# Altium schematic sheet EFR32BG24_PartC.SchDoc: LPEDT_Project_Schematic
size A; Revision: 1; SheetNumber: 6; SheetTotal: 7
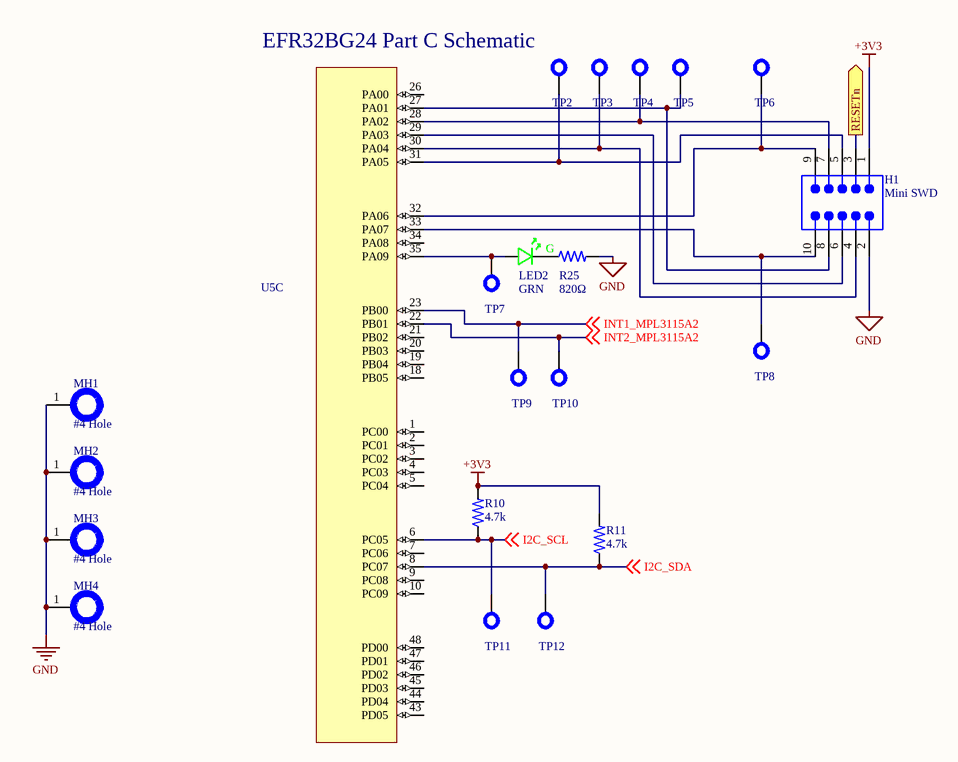
[diagram p0: EFR32BG24_PartC.SchDoc]

## Parts
H1  Mini SWD  [FTSH-105-01-XXX-DV-K]
LED2  GRN  [LED_0603]
MH1  #4 Hole  [HOLE_#4]  (no BOM)
MH2  #4 Hole  [HOLE_#4]  (no BOM)
MH3  #4 Hole  [HOLE_#4]  (no BOM)
MH4  #4 Hole  [HOLE_#4]  (no BOM)
R10  4.7k  [R_0603]
R11  4.7k  [R_0603]
R25  820Ω  [R_0603]
TP2  TP_1PIN_Hole  [Test Point]  (value not drawn)
TP3  TP_1PIN_Hole  [Test Point]  (value not drawn)
TP4  TP_1PIN_Hole  [Test Point]  (value not drawn)
TP5  TP_1PIN_Hole  [Test Point]  (value not drawn)
TP6  TP_1PIN_Hole  [Test Point]  (value not drawn)
TP7  TP_1PIN_Hole  [Test Point]  (value not drawn)
TP8  TP_1PIN_Hole  [Test Point]  (value not drawn)
TP9  TP_1PIN_Hole  [Test Point]  (value not drawn)
TP10  TP_1PIN_Hole  [Test Point]  (value not drawn)
TP11  TP_1PIN_Hole  [Test Point]  (value not drawn)
TP12  TP_1PIN_Hole  [Test Point]  (value not drawn)
U5  EFR32BG24B110F1536IM48-B  [U_48QFN_6x6_2]  (value not drawn)  (part C of 3)

## Ports
RESETn (out, see EFR32BG24_PartB[2A])

## Nets
+3V3: H1.1 R10.2 R11.2
GND: H1.2 MH1.1 MH2.1 MH3.1 MH4.1 R25.2
I2C_SCL: R10.1 TP11.1 U5.6(PC05) ; off-sheet I2C_SCL
I2C_SDA: R11.1 TP12.1 U5.8(PC07) ; off-sheet I2C_SDA
INT1_MPL3115A2: TP9.1 U5.23(PB00) ; off-sheet INT1_MPL3115A2
INT2_MPL3115A2: TP10.1 U5.22(PB01) ; off-sheet INT2_MPL3115A2
RESETn: H1.3 ; port RESETn
NetH1_4: H1.4 TP3.1 U5.30(PA04)
NetH1_5: H1.5 TP2.1 U5.31(PA05)
NetH1_6: H1.6 U5.29(PA03)
NetH1_7: H1.7 TP4.1 U5.28(PA02)
NetH1_8: H1.8 TP5.1 U5.27(PA01)
NetH1_9: H1.9 TP6.1 U5.32(PA06)
NetH1_10: H1.10 TP8.1 U5.33(PA07)
NetLED2_A: LED2.A TP7.1 U5.35(PA09)
NetLED2_C: LED2.C R25.1

Not connected (* = marked no-connect by the designer): U5 1(PC00) 2(PC01) 3(PC02) 4(PC03) 5(PC04) 7(PC06) 9(PC08) 10(PC09) 18(PB05) 19(PB04) 20(PB03) 21(PB02) 26(PA00) 34(PA08) 43(PD05) 44(PD04) 45(PD03) 46(PD02) 47(PD01) 48(PD00)

## Notes on the sheet
- (near TP2) EFR32BG24 Part C Schematic
- (in symbol LED_GREEN_0603) G

## Library data of the parts
H1 = Debug Connector Mini SWD - 0.05": Mini SWD 0.05" Pitch Connector - 10 Pin SMT Box Header; Manufacturer: Adafruit Industries; Manufacturer Part Number: 4048; Supplier 1: Digi-Key; RoHS: No; Category: Connectors; Stock 1: 201; Pricing 1: 1=1.95000 (USD); ComponentLink1URL: https://media.digikey.com/pdf/Data%20Sheets/Adafruit%20PDFs/4048_Web.pdf?src-supplier=Digi-Key; ComponentLink1Description: https://media.digikey.com/pdf/Data%20Sheets/Adafruit%20PDFs/4048_Web.pdf?src-supplier=Digi-Key
LED2 = LED_GREEN_0603: LED, 0603, GREEN, 430MCD, 520NM; Manufacturer: Wurth Electronics; Manufacturer Part Number: 150060GS75000; Dynamic Catalog: 0603 Rectangle with Flat Top Chip LEDs; 3D Model: SMCW_0603.igs / SMCW_0603.stp / SMCW_0603.wrl; Wavelength - Peak: 515nm; Voltage - Forward (Vf) (Typ): 3.2V; Current - Test: 20mA; Viewing Angle: 140°; Lens Type: Clear; Lens Style/Size: Rectangle with Flat Top, 1.1mm x 0.7mm; Other Names: 732-4971-2; Supplier 1: Digi-Key; Stock 1: 34964; Pricing 1: 1=0.14, 50=0.129, 100=0.11, 500=0.095 (USD); Standard Package: 4,000; Category: Optoelectronics; Family: LED Indication - Discrete; Series: WL-SMCW; Packaging: Tape & Reel (TR); Color: Green; Wavelength - Dominant: 520nm; Millicandela Rating: 430mcd; Package / Case: 0603 (1608 Metric); Size / Dimension: 1.60mm L x 0.80mm W; Height: 0.70mm; Mounting Type: Surface Mount; Online Catalog: 0603 Rectangle with Flat Top Chip LEDs; ComponentLink1URL: https://katalog.we-online.de/led/datasheet/150060GS75000.pdf?src-supplier=Digi-Key; ComponentLink1Description: https://katalog.we-online.de/led/datasheet/150060GS75000.pdf?src-supplier=Digi-Key; ComponentLink2URL: http://www.produktinfo.conrad.com/datenblaetter/750000-774999/759427-da-01-en-CHIPLED_0603_W_KL_GRUEN_150060GS75000.pdf?src-supplier=Conrad; ComponentLink2Description: http://www.produktinfo.conrad.com/datenblaetter/750000-774999/759427-da-01-en-CHIPLED_0603_W_KL_GRUEN_150060GS75000.pdf?src-supplier=Conrad; Supplier Part Number 1: 732-4971-1-ND
MH1-MH4 = HOLE_#4
R10 R11 = R_4K7_0603: Fixed Resistor, Metal Glaze/thick Film, 0.1W, 4700ohm, 75V, 1% +/-Tol, 100ppm/Cel, Surface Mount, 0603; Manufacturer: Yageo; Manufacturer Part Number: RC0603FR-074K7L; Additional Feature: LASER TRIMMABLE; Power: 100mW; Rated Temperature: 70°C; Value: 4.7kR; Temperature Coefficient: 100ppm/°C; Package Height: 0.45mm; Package Length: 1.6mm; Package Width: 0.8mm; Supplier: Digikey; Supplier Part Number: 311-4.70KHRCT-ND; RoHS: Yes; Category: Chip SMD Resistors; Stock: 5392197; Pricing: 1=0.1, 10=0.019, 50=0.0112, 100=0.0093, 500=0.00622, 1000=0.00532 (USD); Mounting Technology: Surface Mount; Pins: 2; Package Shape: Rectangular; Case/Package: 0603; Terminal Finish: Nickel; Min Operating Temperature: -55°C; Max Operating Temperature: 155°C; Tolerance: 1%; JESD-609 Code: e3; Resistor Type: FIXED RESISTOR; Construction: Chip; Package Style: SMTMeter; Packaging: Tape and Reel; Technology: METAL GLAZE/THICK FILM; Termination: Wraparound; Working Voltage: 75V; Reach SVHC Compliant: Yes; RoHS Compliant: Yes; ComponentLink1URL: https://datasheet.ciiva.com:443/pdfs/VipMasterIC/IC/YAGO/YAGO-S-A0008145938/YAGO-S-A0008145938-1.pdf?src-supplier=IHS+Markit; ComponentLink1Description: https://datasheet.ciiva.com:443/pdfs/VipMasterIC/IC/YAGO/YAGO-S-A0008145938/YAGO-S-A0008145938-1.pdf?src-supplier=IHS+Markit; ComponentLink2URL: https://datasheet.ciiva.com/15189/getdatasheetpartid-422754-15189760.pdf?src-supplier=Verical; ComponentLink2Description: https://datasheet.ciiva.com/15189/getdatasheetpartid-422754-15189760.pdf?src-supplier=Verical; ComponentLink3URL: https://datasheet.ciiva.com/7660/38590-7660794.pdf?src-supplier=Element14; ComponentLink3Description: https://datasheet.ciiva.com/7660/38590-7660794.pdf?src-supplier=Element14; ComponentLink4URL: https://datasheet.ciiva.com/22747/443971-22747528.pdf?src-supplier=Element14; ComponentLink4Description: https://datasheet.ciiva.com/22747/443971-22747528.pdf?src-supplier=Element14; ComponentLink5URL: https://datasheet.ciiva.com/46440/1868787-46440909.pdf?src-supplier=Element14; ComponentLink5Description: https://datasheet.ciiva.com/46440/1868787-46440909.pdf?src-supplier=Element14; ComponentLink6URL: https://datasheet.ciiva.com/7746/1868787-7746365.pdf?src-supplier=Element14; ComponentLink6Description: https://datasheet.ciiva.com/7746/1868787-7746365.pdf?src-supplier=Element14; ComponentLink7URL: https://datasheet.ciiva.com/7746/1738695-7746366.pdf?src-supplier=Element14; ComponentLink7Description: https://datasheet.ciiva.com/7746/1738695-7746366.pdf?src-supplier=Element14
R25 = R_820_0603: RES 820OHM 0.1W 0603; Manufacturer: Stackpole Electronics; Manufacturer Part Number: RMCF0603FT820R; Tolerance: 1%; Power: 100mW; Rated Temperature: 70°C; Value: 820R; Temperature Coefficient: 100ppm/°C; Working Voltage: 75V; Package Height: 0.45mm; Package Length: 1.55mm; Package Width: 0.8mm; Reference Standard: AEC-Q200; Supplier: Digikey; Supplier Part Number: RMCF0603FT820RDKR-ND; RoHS: Yes; Category: Chip SMD Resistors; Stock: 449150; Pricing: 1=0.1, 10=0.015, 50=0.009, 100=0.0075, 500=0.00498, 1000=0.00425 (USD); Mounting Technology: Surface Mount; Pins: 2; Package Shape: Rectangular; Case/Package: 0603; Terminal Finish: Nickel; Min Operating Temperature: -55°C; Max Operating Temperature: 155°C; JESD-609 Code: e3; Resistor Type: FIXED RESISTOR; Construction: Rectangular; Package Style: SMTMeter; Packaging: Tape and Reel; Technology: METAL GLAZE/THICK FILM; Termination: Wraparound; Reach SVHC Compliant: Yes; RoHS Compliant: Yes; ComponentLink1URL: https://datasheet.ciiva.com:443/pdfs/VipMasterIC/IC/SEIE/SEIE-S-A0009541969/SEIE-S-A0009541969-1.pdf?src-supplier=IHS+Markit; ComponentLink1Description: https://datasheet.ciiva.com:443/pdfs/VipMasterIC/IC/SEIE/SEIE-S-A0009541969/SEIE-S-A0009541969-1.pdf?src-supplier=IHS+Markit; ComponentLink2URL: https://www.seielect.com/catalog/SEI-RMCF_RMCP.pdf?src-supplier=Avnet; ComponentLink2Description: https://www.seielect.com/catalog/SEI-RMCF_RMCP.pdf?src-supplier=Avnet; ComponentLink3URL: https://www.seielect.com/Catalog/SEI-RMCF_RMCP.pdf?src-supplier=Digikey; ComponentLink3Description: https://www.seielect.com/Catalog/SEI-RMCF_RMCP.pdf?src-supplier=Digikey; ComponentLink4URL: https://www.seielect.com/catalog/SEI-Packaging.pdf?src-supplier=Digikey; ComponentLink4Description: https://www.seielect.com/catalog/SEI-Packaging.pdf?src-supplier=Digikey
TP2-TP12 = TP_1PIN_Hole: 200 mil hole test point
U5 = EFR32BG24B110F1536IM48-B: BG24, 2.4 GHz, 1536kB Flash, 256kB RAM, +10 dBm, Secure Vault High, 20-bit ADC +125C, QFN48; Manufacturer: Silicon Labs; Supplier: Digikey; Supplier Part Number: 336-EFR32BG24B110F1536IM48-B-ND; Manufacturer Part Number: EFR32BG24B110F1536IM48-B; RoHS: No; Category: RF Receivers, Transceivers; Stock: 2713; Pricing: 1=7.9, 10=7.244, 25=6.5852, 80=5.92663, 230=5.43278, 490=4.9389, 980=4.44501 (USD)